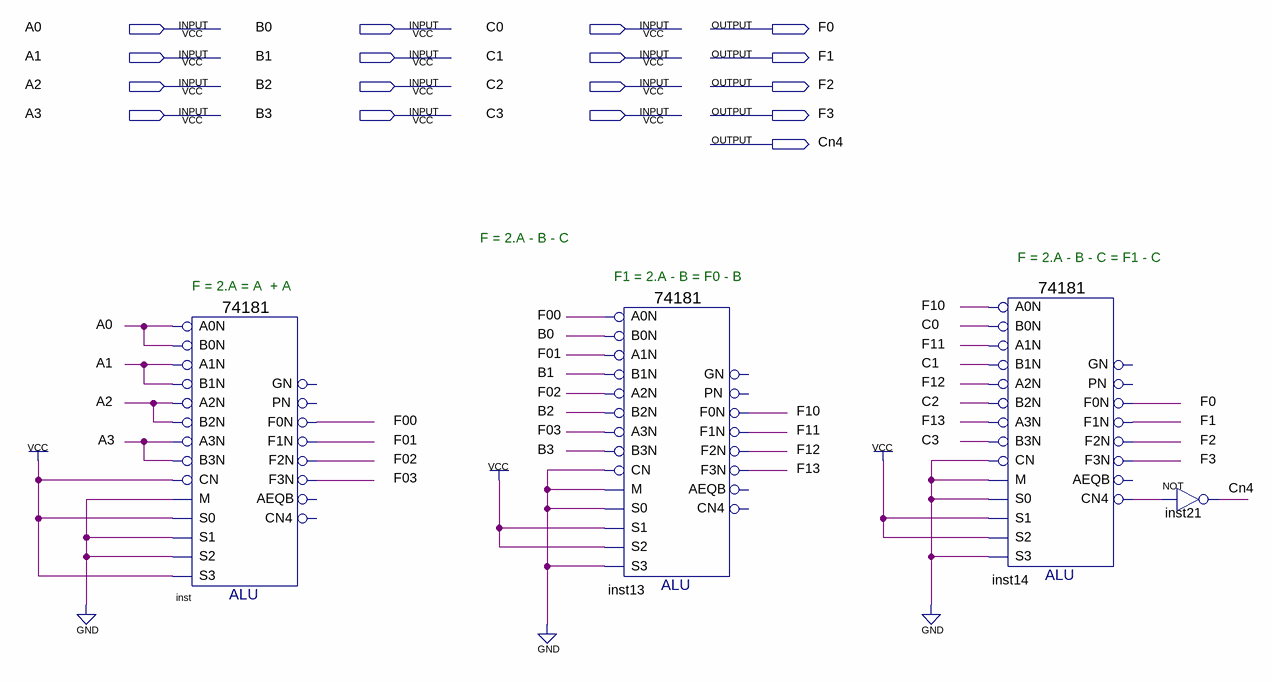
[diagram p0: schematic sheet]
// Quartus schematic ex5.bdf as structural Verilog: 4 symbols, 17 pins
module ex5 (
  input  A0,
  input  B0,
  input  C0,
  input  A1,
  input  B1,
  input  C1,
  input  A2,
  input  B2,
  input  C2,
  input  A3,
  input  B3,
  input  C3,
  output F0,
  output F1,
  output F2,
  output F3,
  output Cn4
);

  wire F00, F01, F02, F03, F10, F11, F12, F13, inst14_cn4;

  \74181  inst (
    .B0N(A0), .A0N(A0), .A1N(A1), .B1N(A1), .A3N(A3), .B2N(A2), .A2N(A2), .M(1'b0), .CN(1'b1), .B3N(A3),
    .S2(1'b0), .S1(1'b0), .S0(1'b1), .S3(1'b1), .F3N(F03), .F1N(F01), .F0N(F00), .F2N(F02));  // open: PN, GN, AEQB, CN4
  \74181  inst13 (
    .B0N(B0), .A0N(F00), .A1N(F01), .B1N(B1), .A3N(F03), .B2N(B2), .A2N(F02), .M(1'b0), .CN(1'b0), .B3N(B3),
    .S2(1'b1), .S1(1'b1), .S0(1'b0), .S3(1'b0), .F3N(F13), .F1N(F11), .F0N(F10), .F2N(F12));  // open: PN, GN, AEQB, CN4
  \74181  inst14 (
    .B0N(C0), .A0N(F10), .A1N(F11), .B1N(C1), .A3N(F13), .B2N(C2), .A2N(F12), .M(1'b0), .CN(1'b0), .B3N(C3),
    .S2(1'b1), .S1(1'b1), .S0(1'b0), .S3(1'b0), .F3N(F3), .F1N(F1), .F0N(F0), .CN4(inst14_cn4), .F2N(F2));  // open: PN, GN, AEQB
  not inst21 (Cn4, inst14_cn4);

  // Notes on the sheet:
  //   F = 2.A - B - C
  //   F = 2.A - B - C = F1 - C
  //   F1 = 2.A - B = F0 - B
  //   F = 2.A = A  + A
endmodule
